# Altium schematic sheet leo_BMS_MCU.SchDoc
size 400 x 289 mm; SheetNumber: 6; SheetTotal: 6
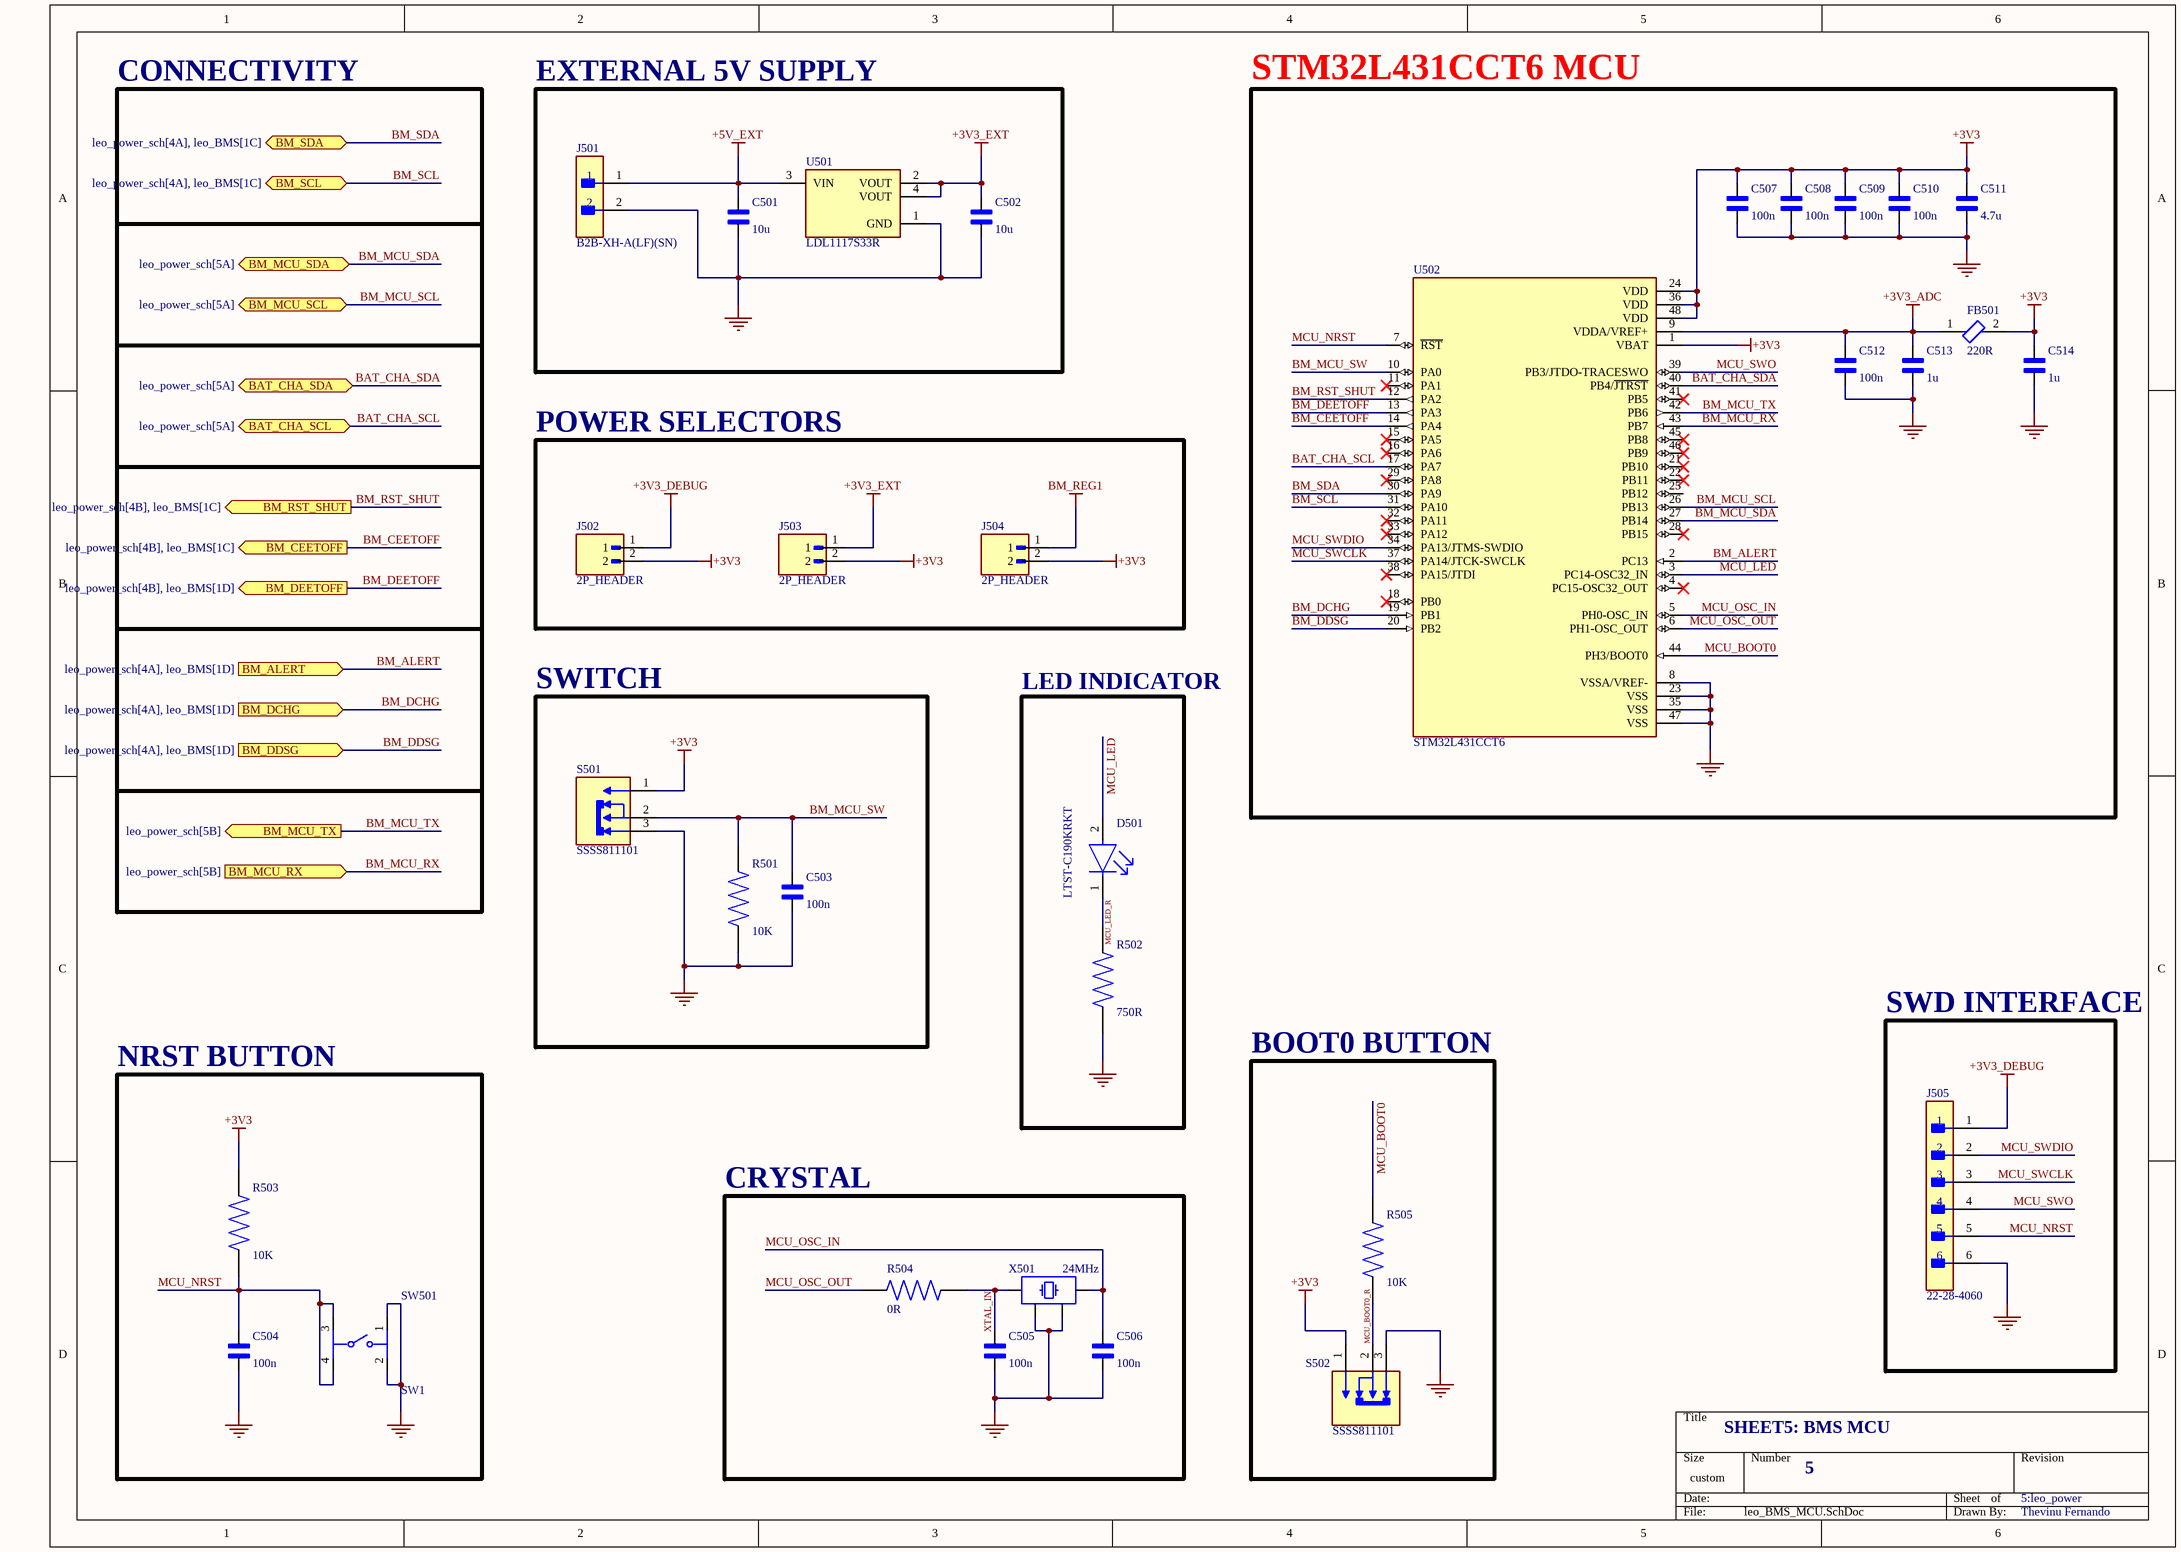
[diagram p0: leo_BMS_MCU.SchDoc]

## Parts
C501  10u  [CAP_0805]
C502  10u  [CAP_0805]
C503  100n  [CAP_0402]
C504  100n  [CAP_0402]
C505  100n  [CAP_0402]
C506  100n  [CAP_0402]
C507  100n  [CAP_0402]
C508  100n  [CAP_0402]
C509  100n  [CAP_0402]
C510  100n  [CAP_0402]
C511  4.7u  [CAP_0603]
C512  100n  [CAP_0402]
C513  1u  [CAP_0603]
C514  1u  [CAP_0603]
D501  LTST-C190KRKT  [FP-LTST-C190KRKT-MFG]
FB501  220R  [FP-MPZ1608-0_8-IPC_B]
J501  B2B-XH-A(LF)(SN)  [FP-B2B-XH-A_LF_SN-MFG]
J502  2P_HEADER  [HARWIN_M20-9990246 2P Header]
J503  2P_HEADER  [HARWIN_M20-9990246 2P Header]
J504  2P_HEADER  [HARWIN_M20-9990246 2P Header]
J505  22-28-4060  [FP-22-28-4060-MFG]
R501  10K  [RES_0402]
R502  750R  [RES_0603]
R503  10K  [RES_0402]
R504  0R  [RES_0402]
R505  10K  [RES_0402]
S501  SSSS811101  [SW_SSSS811101]
S502  SSSS811101  [SW_SSSS811101]
SW501  SW1  [FP-PTS645SM43SMTR92LFS-MFG]
U501  LDL1117S33R  [FP-SOT223-0046067-IPC_A]
U502  STM32L431CCT6  [QFP50P900X900X160-48N]
X501  24MHz  [XTAL_3225]

## Blocks framed on the sheet
EXTERNAL 5V SUPPLY: C501 C502 J501 U501
STM32L431CCT6 MCU: C507-C514 FB501 U502
POWER SELECTORS: J502-J504
SWITCH: C503 R501 S501
LED INDICATOR: D501 R502
SWD INTERFACE: J505
NRST BUTTON: C504 R503 SW501
BOOT0 BUTTON: R505 S502
CRYSTAL: C505 C506 R504 X501

## Ports
BAT_CHA_SCL (bidir, see leo_power_sch[5A]), BAT_CHA_SDA (bidir, see leo_power_sch[5A]), BM_ALERT (in, see leo_power_sch[4A], leo_BMS[1D]), BM_CEETOFF (out, see leo_power_sch[4B], leo_BMS[1C]), BM_DCHG (in, see leo_power_sch[4A], leo_BMS[1D]), BM_DDSG (in, see leo_power_sch[4A], leo_BMS[1D]), BM_DEETOFF (out, see leo_power_sch[4B], leo_BMS[1D]), BM_MCU_RX (in, see leo_power_sch[5B]), BM_MCU_SCL (bidir, see leo_power_sch[5A]), BM_MCU_SDA (bidir, see leo_power_sch[5A]), BM_MCU_TX (out, see leo_power_sch[5B]), BM_RST_SHUT (out, see leo_power_sch[4B], leo_BMS[1C]), BM_SCL (bidir, see leo_power_sch[4A], leo_BMS[1C]), BM_SDA (bidir, see leo_power_sch[4A], leo_BMS[1C])

## Nets
+3V3: C507.2 C508.2 C509.2 C510.2 C511.2 C514.2 FB501.2 J502.2 J503.2 J504.2 R503.2 S501.1 S502.1 U502.1(VBAT) U502.24(VDD) U502.36(VDD) U502.48(VDD)
+3V3_ADC: C512.2 C513.2 FB501.1 U502.9(VDDA/VREF+)
+3V3_DEBUG: J502.1 J505.1
+3V3_EXT: C502.1 J503.1 U501.2(VOUT) U501.4(VOUT)
+5V_EXT: C501.1 J501.1 U501.3(VIN)
BM_REG1: J504.1
GND: C501.2 C502.2 C503.1 C504.1 C505.1 C506.1 C507.1 C508.1 C509.1 C510.1 C511.1 C512.1 C513.1 C514.1 J501.2 J505.6 R501.1 R502.1 S501.3 S502.3 SW501.1 SW501.2 U501.1(GND) U502.8(VSSA/VREF-) U502.23(VSS) U502.35(VSS) U502.47(VSS) X501.2 X501.4
BAT_CHA_SCL: U502.17(PA7) ; port BAT_CHA_SCL
BAT_CHA_SDA: U502.40(PB4/~{JTRST}) ; port BAT_CHA_SDA
BM_ALERT: U502.2(PC13) ; port BM_ALERT
BM_CEETOFF: U502.14(PA4) ; port BM_CEETOFF
BM_DCHG: U502.19(PB1) ; port BM_DCHG
BM_DDSG: U502.20(PB2) ; port BM_DDSG
BM_DEETOFF: U502.13(PA3) ; port BM_DEETOFF
BM_MCU_RX: U502.43(PB7) ; port BM_MCU_RX
BM_MCU_SCL: U502.26(PB13) ; port BM_MCU_SCL
BM_MCU_SDA: U502.27(PB14) ; port BM_MCU_SDA
BM_MCU_SW: C503.2 R501.2 S501.2 U502.10(PA0)
BM_MCU_TX: U502.42(PB6) ; port BM_MCU_TX
BM_RST_SHUT: U502.12(PA2) ; port BM_RST_SHUT
BM_SCL: U502.31(PA10) ; port BM_SCL
BM_SDA: U502.30(PA9) ; port BM_SDA
MCU_BOOT0: R505.2 U502.44(PH3/BOOT0)
MCU_BOOT0_R: R505.1 S502.2
MCU_LED: D501.2(A) U502.3(PC14-OSC32_IN)
MCU_LED_R: D501.1(C) R502.2
MCU_NRST: C504.2 J505.5 R503.1 SW501.3 SW501.4 U502.7(~{RST})
MCU_OSC_IN: C506.2 U502.5(PH0-OSC_IN) X501.3
MCU_OSC_OUT: R504.2 U502.6(PH1-OSC_OUT)
MCU_SWCLK: J505.3 U502.37(PA14/JTCK-SWCLK)
MCU_SWDIO: J505.2 U502.34(PA13/JTMS-SWDIO)
MCU_SWO: J505.4 U502.39(PB3/JTDO-TRACESWO)
XTAL_IN: C505.2 R504.1 X501.1

Not connected (* = marked no-connect by the designer): U502 4(PC15-OSC32_OUT)* 11(PA1)* 15(PA5)* 16(PA6)* 18(PB0)* 21(PB10)* 22(PB11)* 25(PB12) 28(PB15)* 29(PA8)* 32(PA11)* 33(PA12)* 38(PA15/JTDI)* 41(PB5)* 45(PB8)* 46(PB9)*

## Notes on the sheet
- CONNECTIVITY
- SHEET5: BMS MCU
- 5
- 5:leo_power
- Thevinu Fernando

## Library data of the parts
C501 C502 = CAP_0805: Ceramic Capacitor X7R 0805 (2012 Metric); MF: Samsung Electro-Mechanics; MP: CL21B106KOQNNNE; SnapEDA_Link: https://www.snapeda.com/parts/CL21B106KOQNNNE/Samsung+Electro-Mechanics/view-part/?ref=snap; Package: 0805 Samsung; Value: *; Check_prices: https://www.snapeda.com/parts/CL21B106KOQNNNE/Samsung+Electro-Mechanics/view-part/?ref=eda
C503-C510 C512 = CAP_0402: ±10% 50V Ceramic Capacitor X7R 0402; MF: Samsung; MP: CL05B104KO5NNNC; SnapEDA_Link: https://www.snapeda.com/parts/CL05B104KO5NNNC/Samsung/view-part/?ref=snap; Package: SMD-2-2 Samsung; Value: *; Check_prices: https://www.snapeda.com/parts/CL05B104KO5NNNC/Samsung/view-part/?ref=eda
C511 C513 C514 = CAP_0603: Â±10% 50V Ceramic Capacitor X7R 0603 (1608 Metric); MF: Samsung Electro-Mechanics; MP: CL10B104KB8NNNC; SnapEDA_Link: https://www.snapeda.com/parts/CL10B104KB8NNNC/Samsung/view-part/?ref=snap; Package: SMD-2 Samsung; Value: *; Check_prices: https://www.snapeda.com/parts/CL10B104KB8NNNC/Samsung/view-part/?ref=eda
D501 = RED_LED: LED RED CLEAR CHIP SMD; Reverse Voltage: 5V; Viewing Angle: 130°; Power Rating: 75mW; Test Current: 20mA; Number of Elements: 1; Lens Color: Colorless; Wavelength: 639nm; Dominant Wavelength: 631nm; Lens Style: Diffused; Forward Current: 30mA; Forward Voltage: 2.4V; Luminous Intensity: 54mcd; Color: Red; Case Code (Imperial): 0603; Lens Transparency: Clear; Lead Free: Lead Free; Package Quantity: 1; Packaging: Tape and Reel; Max Operating Temperature: 85°C; Number of Pins: 2; Height: 0.8mm; Case/Package: 0603; Number of LEDs: 1; Width: 0.8mm; Case Code (Metric): 1608; Depth: 0.8mm; Mount: Surface Mount; Radiation Hardening: No; Length: 1.6mm; Illumination Color: Red; Power Dissipation: 75mW; Min Operating Temperature: -55°C
FB501 = Ferrite_Bead_220R_0603: Power line Ferrite Bead 220Ω @ 100MHz 2.2A DCR 0.05Ω SMD 0603; DC Resistance (DCR): 50mR; Tolerance: 25%; Series: MPZ; Width: 0.031inch; REACH SVHC: No SVHC; Case Code (Imperial): 0603; Current Rating: 2.2A; Case/Package: 0603; Packaging: Cut Tape; Height: 0.037inch; Number of Pins: 2; Max DC Current: 2.2A; Lead Free: Lead Free; RoHS Compliant: Yes; Mount: Surface Mount; Case Code (Metric): 1608; Length: 0.063inch; Package Quantity: 1; Impedance: 220R; Core Material: Ferrite
J501 = B2B-XH-A(LF)(SN): CONN HEADER VERT 2POS 2.5MM; Current Rating: 3A; Voltage Rating: 250V; Number of Contacts: 2; Contact Resistance: 20mR; Wire/Cable Gauge: 22AWG; Insulation Resistance: 1GR; Connector Type: Male Pin; Packaging: Bulk; Contact Material: Brass; Lead Free: Lead Free; Orientation: Straight; Contact Plating: Tin; Max Current Rating: 3A; Termination: Solder; Fastening Type: Detent; Depth: 5.75mm; Housing Material: Polyamide; REACH SVHC: No SVHC; Series: XH; Voltage Rating (AC): 250V; Number of Positions: 2; Color: Natural; Contact Type: Male Pin; Max Voltage Rating (DC): 250V; Pitch: 2.5mm; Lead Pitch: 2.5mm; Mount: Through Hole; Max Operating Temperature: 85°C; Length: 7.4mm; Max Voltage Rating (AC): 250V; Min Operating Temperature: -25°C; Number of Rows: 1; Housing Color: White
J502-J504 = 2P_HEADER: 2.54mm (0.1) Pitch SIL Vertical Throughboard Pin Header, 6.1mm mating pin height, tin, 2 contacts; MF: Harwin; MP: M20-9990246; SnapEDA_Link: https://www.snapeda.com/parts/M20-9990246/Harwin/view-part/?ref=snap; Package: None; Value: *; Check_prices: https://www.snapeda.com/parts/M20-9990246/Harwin/view-part/?ref=eda
J505 = 6P_M_HEADER: CONN HEADER VERT 6POS 2.54MM; Voltage Rating: 250V; Current Rating: 4A; Number of Contacts: 6; Max Voltage Rating (DC): 250.25kV; Gender: Male; Contact Resistance: 20mR; Connector Type: Male Pin; Color: Black; Max Voltage Rating (AC): 250V; Pitch: 2.54mm; Orientation: Straight; Max Operating Temperature: 75°C; Contact Plating: Tin; Depth: 2.49mm; Contact Type: Male Pin; Number of Positions: 6; Length: 15.24mm; Packaging: Bulk; Mount: Through Hole; Housing Material: Thermoplastic; Housing Color: Black; Termination: Solder; Contact Material: Brass; Min Operating Temperature: 0°C; Series: KK® 42375; Number of Rows: 1; Package Quantity: 1; RoHS Compliant: Yes; Contact Mating Length: 0.24inch
R501 R503-R505 = RES_0402: Chip Resistor 0402 (1005 Metric) Automotive AEC-Q200 Thick Film; MF: Panasonic; MP: ERJ-2RKF1002X; Package: 1005-2 Panasonic; Price: None; Check_prices: https://www.snapeda.com/parts/ERJ-2RKF1002X/Panasonic%20Electronic%20Components/view-part/78636/?ref=eda; Value: *; SnapEDA_Link: https://www.snapeda.com/parts/ERJ-2RKF1002X/Panasonic%20Electronic%20Components/view-part/78636/?ref=snap; Availability: In Stock
R502 = RES_0603: Â±1% 0.1W, 1/10W Chip Resistor 0603 (1608 Metric) Moisture Resistant Thick Film; MF: Yageo; MP: RC0603FR-0791KL; SnapEDA_Link: https://www.snapeda.com/parts/RC0603FR-0791KL/Yageo/view-part/?ref=snap; Package: 1608 Yageo; Value: *; Check_prices: https://www.snapeda.com/parts/RC0603FR-0791KL/Yageo/view-part/?ref=eda
S501 S502 = SSSS811101: Switch Slide SP Side Slide 0.3A 5VDC 10000Cycles Gull Wing SMD T/R; MF: ALPS; SnapEDA_Link: https://www.snapeda.com/parts/SSSS811101/ALPS/view-part/?ref=snap; Package: None; Value: *; MP: SSSS811101; Check_prices: https://www.snapeda.com/parts/SSSS811101/ALPS/view-part/?ref=eda
SW501 = PTS645SM43SMTR92LFS: Tactile Switch SPST 160gf 4.3mm Gull Wing 6mm x 6mm Surface Mount; Contact Resistance: 100mR; Illumination Type: Non-Illuminated; Mechanical Life: 100000Cycles; Voltage Rating (DC): 12V; Current Rating: 50mA; Switch Function: Off-Mom; Actuator Length: 0.85mm; Actuator Material: Nylon; Actuator Type: Standard; Min Operating Temperature: -20°C; REACH SVHC: No SVHC; Termination: Gull Wing; Throw Configuration: SPST; Case/Package: SMD/SMT; Packaging: Tape and Reel; Mount: Surface Mount; Orientation: Straight; Lead Free: Lead Free; Contact Material: Silver; Color: Black; Max Current Rating: 50mA; Contact Plating: Silver; Depth: 9mm; Package Quantity: 1; Max Voltage Rating (DC): 12V; Operating Force: 160gf; Length: 6mm; Max Operating Temperature: 60°C
U501 = LDO_LDL1117S33R: IC REG LINEAR 3.3V 1.2A SOT223; Manufacturer: STMicroelectronics; Output Type: Fixed; Min Supply Voltage: 2.6V; Number Of Outputs: 1; Dropout Voltage: 350mV; Output Current: 2A; Nominal Supply Current: 250uA; Standoff Height: 0.02mm; Max Supply Voltage: 18V; Max Junction Temp: +125°C; Accuracy Percentage: 2%; Automotive: No; Device Class L2: Power Management ICs; Height: 1.9mm; Octopart: https://octopart.com/ldl1117s33r-stmicroelectronics-81876163; Output Voltage: 3.3V; Package: SOT223-0046067; Lead Free: Yes; Temperature Range Low: -40°C; Category: IC; Device Class L1: Integrated Circuits (ICs); Ipc Land Pattern Name: SOT230P700X190-4; Mouser Description: LDL1117 Series 1.2 A 3.3 V High PSRR LDO Linear Voltage Regulator-SOT-223; ComponentLink2Description: Datasheet; ComponentLink2URL: https://www.st.com/resource/en/datasheet/ldl1117.pdf; Device Class L3: Voltage Regulators - Linear; Manufacturer Part Number: LDL1117S33R; Temperature Range High: +125°C; Digikey Description: IC REG LINEAR 3.3V 1.2A SOT223; Temperature: -40°C to +125°C; RoHS: TRUE
U502 = STM32L431CCT6: ARMÂ® CortexÂ®-M4 STM32L4 Microcontroller IC 32-Bit Single-Core 80MHz 256KB (256K x 8) FLASH 48-LQFP (7x7); MF: STMicroelectronics; SnapEDA_Link: https://www.snapeda.com/parts/STM32L431CCT6/STMicroelectronics/view-part/?ref=snap; Package: LQFP-48 STMicroelectronics; Value: *; MP: STM32L431CCT6; Check_prices: https://www.snapeda.com/parts/STM32L431CCT6/STMicroelectronics/view-part/?ref=eda
X501 = TSX-3225_24.0000MF15X-AC: Crystal SMD 24MHz 10PPM 7pF 3225; Manufacturer: Epson; Manufacturer Part Number: TSX-3225 24.0000MF15X-AC